# EAGLE design Sensor_board (EAGLE 9.3.0)
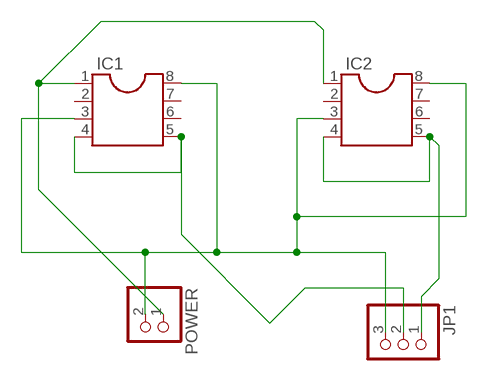
[diagram p0: schematic, sheet 1]

## Parts
IC1  DIL8S  [SOCKET-08]
IC2  DIL8S  [SOCKET-08]
JP1  PINHD-1X3  [1X03]
POWER  PINHD-1X2  [1X02]

## Nets
N$1: IC1.3 IC1.8 IC2.3 IC2.8 JP1.3 POWER.2
N$2: IC1.1 IC2.1 POWER.1
N$4: IC1.4 IC1.5 JP1.2
N$5: IC2.4 IC2.5 JP1.1
Unconnected: IC1.2 IC1.6 IC1.7 IC2.2 IC2.6 IC2.7

## Library data of the parts
IC1 IC2 = ic-package:DIL8: Dual In Line / Socket
JP1 = pinhead:PINHD-1X3: PIN HEADER
POWER = pinhead:PINHD-1X2: PIN HEADER

## Board
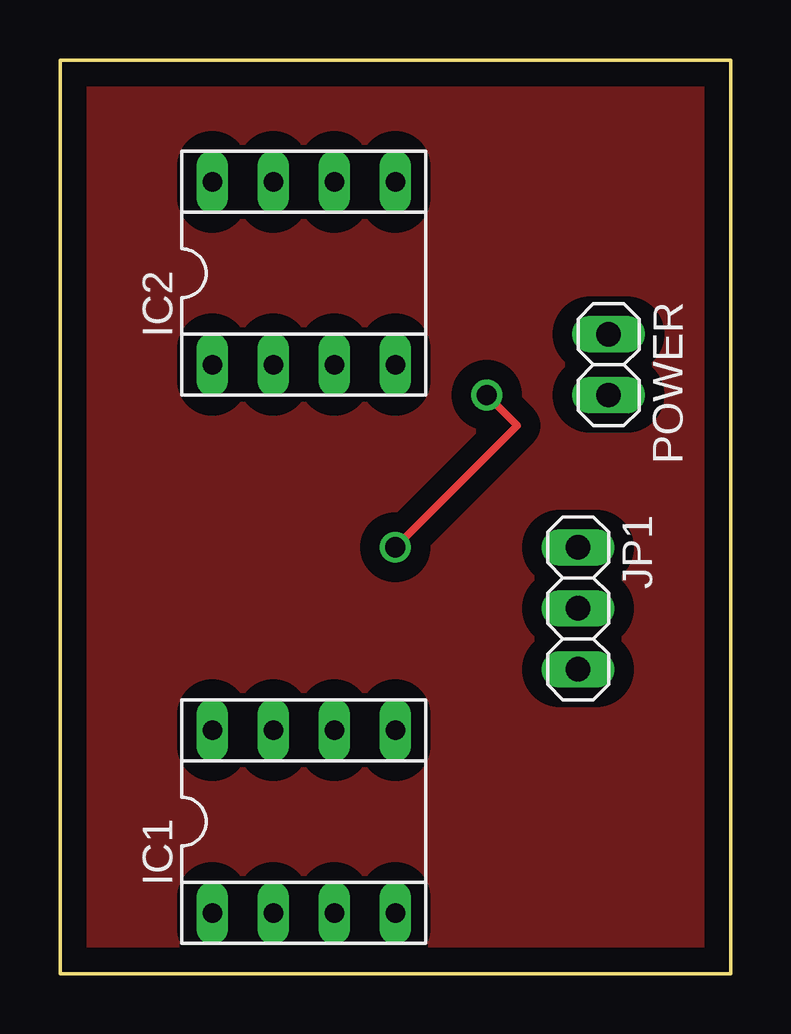
[diagram p1: board, top side]
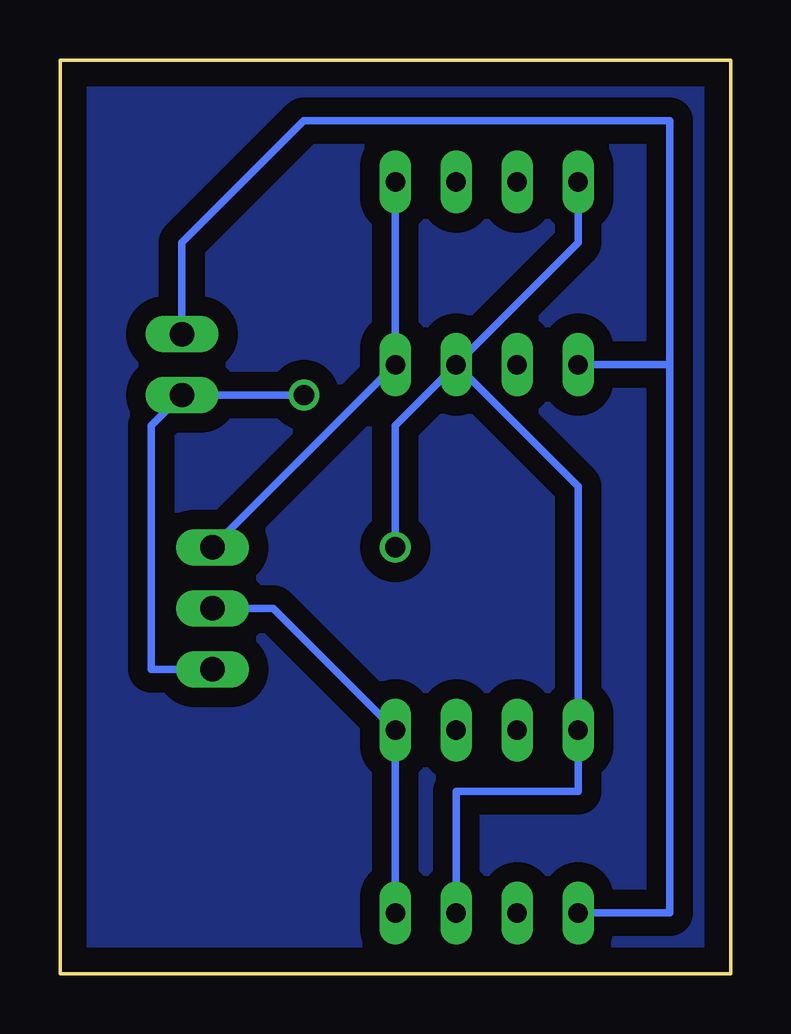
[diagram p2: board, bottom side, seen from below]

Size 27.94 x 38.1 mm. Coordinates in mm from the lower left corner, seen from the top.
Outline: 0,0 0,38.1 27.94,38.1 27.94,0 0,0
Copper layers (1*16): Top 0.035mm / dielectric 1.5mm / Bottom 0.035mm
Design rules "default": minimum track width 6mil, minimum drill 0.35mm, track to track 6mil, track to pad 6mil, pad to pad 6mil, via to via 6mil, smd to smd 6mil, copper to edge 40mil, drill to drill 6mil, minimum pad ring 10mil, minimum via ring 8mil, stop-mask expansion 4mil, vias tented up to drill 0mil, thermal gap 10mil

### Footprints (pad centres in the part's own frame; a part is rotated, then mirrored left to right if it is on the bottom)
SOCKET-08 = drill 0.813 long: 1 -3.81,-3.81; 2 -1.27,-3.81; 3 1.27,-3.81; 4 3.81,-3.81; 5 3.81,3.81; 6 1.27,3.81; 7 -1.27,3.81; 8 -3.81,3.81
1X03 = drill 1.016 long: 1 -2.54,0; 2 0,0; 3 2.54,0
1X02 = drill 1.016 long: 1 -1.27,0; 2 1.27,0

### Placement (x,y rotation side)
IC1  10.16,6.35 0 top
IC2  10.16,29.21 0 top
JP1  21.59,15.24 270 top
POWER  22.86,25.4 270 top

### Tracks (layer width: path | path; a pad name or v marks a point on that pad's centre or on a via)
BOTTOMPOUR
  pour Bottom (isolate 0.813): 0,0 0,38.1 27.94,38.1 27.94,0
N$1  (via drill 0.85)
  Top 0.305: v17.78,24.13 19.05,22.86 v13.97,17.78
  Bottom 0.305: IC1.3 11.43,7.62 6.35,7.62 IC1.8 6.35,20.32 IC2.3 | IC2.8 6.35,30.48 7.62,29.21 IC2.3 | JP1.3 24.13,12.7 24.13,22.86 POWER.2 v17.78,24.13 | IC2.3 13.97,22.86 v13.97,17.78
N$2
  Bottom 0.305: IC1.1 2.54,2.54 2.54,25.4 | 2.54,25.4 IC2.1 | POWER.1 22.86,30.48 17.78,35.56 2.54,35.56 2.54,25.4
N$3
  pour Top (isolate 0.813): 0,0 0,38.1 27.94,38.1 27.94,0
N$4
  Bottom 0.305: IC1.4 IC1.5 19.05,15.24 JP1.2
N$5
  Bottom 0.305: IC2.5 IC2.4 JP1.1